# Altium schematic sheet 110_ESP32s3.SchDoc
size A4; SheetNumber: 12; SheetTotal: 12
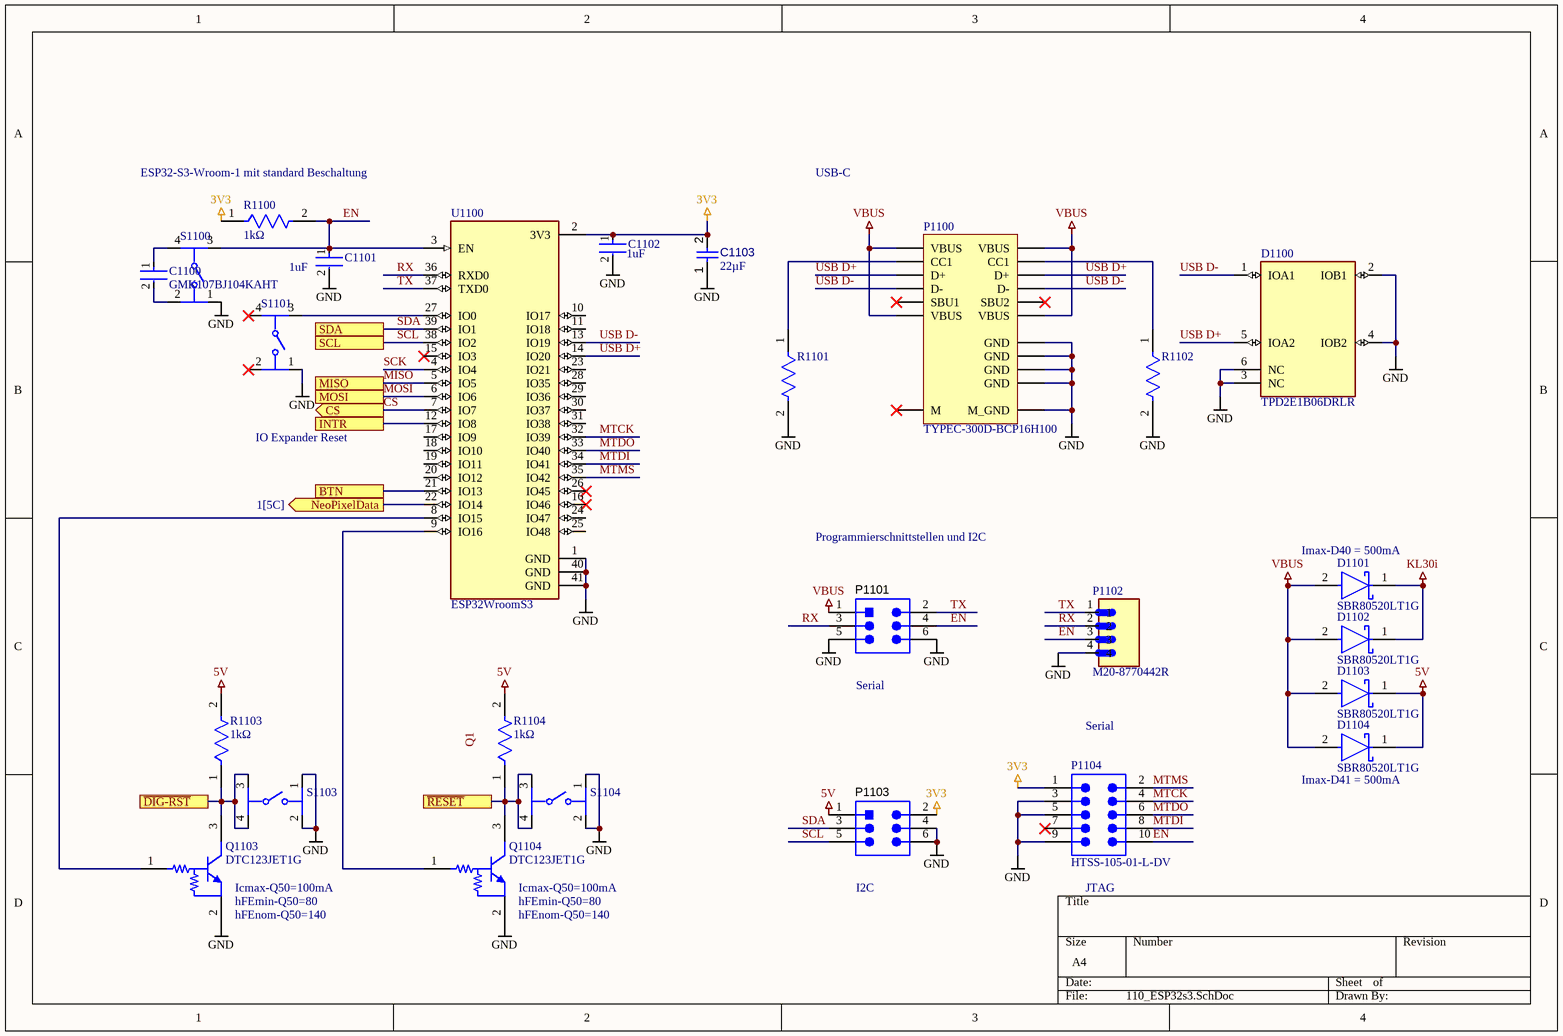
[diagram p0: 110_ESP32s3.SchDoc]

## Parts
C1100  GMK107BJ104KAHT  [FP-0603-L_1_6_0_1-W_0_8_0-IPC_B]
C1101  1uF  [FP-CGA3E-0_3-0_1-MFG]
C1102  1uF  [FP-CGA3E-0_3-0_1-MFG]
C1103  value 22µF  [CAPC0805(2012)145_L]  (hidden comment: Capacitor 22µF +/-40% 16V 0805)
D1100  TPD2E1B06DRLR  [FP-DRL0006A-MFG]
D1101  SBR80520LT1G  [FP-425-04-MFG]
D1102  SBR80520LT1G  [FP-425-04-MFG]
D1103  SBR80520LT1G  [FP-425-04-MFG]
D1104  SBR80520LT1G  [FP-425-04-MFG]
P1100  TYPEC-300D-BCP16H100  [TYPEC-300D-BCP16H100-Footprint-1]
P1101  5-146130-2  [TECO-5-146130-2_V]  (value not drawn)
P1102  M20-8770442R  [HARWIN_M20-8770442R]
P1103  5-146130-2  [TECO-5-146130-2_V]  (value not drawn)
P1104  HTSS-105-01-L-DV  [SMTC-HTSS-105-01-X-DV]
Q1103  DTC123JET1G  [ONSC-SC-75-3-463-01_V]
Q1104  DTC123JET1G  [ONSC-SC-75-3-463-01_V]
R1100  1kΩ  [FP-CRCW0603-e3-MFG]
R1101  CRCW06035K10FKEA  [FP-CRCW0603-e3-IPC_C]  (value not drawn)
R1102  CRCW06035K10FKEA  [FP-CRCW0603-e3-IPC_C]  (value not drawn)
R1103  1kΩ  [FP-CRCW0603-e3-MFG]
R1104  1kΩ  [FP-CRCW0603-e3-MFG]
S1100  (no value)  [FP-PTS645SM43SMTR92LFS-MFG]
S1101  (no value)  [FP-PTS645SM43SMTR92LFS-MFG]
S1103  (no value)  [FP-PTS645SM43SMTR92LFS-MFG]
S1104  (no value)  [FP-PTS645SM43SMTR92LFS-MFG]
U1100  ESP32WroomS3  [ESP32WroomS3]

## Ports
BTN (see 1[5B], 7[4C]), CS (out, see 1[5B], 10[3C]), INTR (see 1[5C], 10[4C]), MISO (see 1[5C], 10[4C]), MOSI (see 1[5B], 10[3D]), NeoPixelData (out, see 1[5C]), SCL (see 1[5C], 2[1C], 6[1C], 9[6B]), SDA (see 1[5C], 2[1C], 6[1C], 9[6B]), ~{DIG-RST} (see 1[5C], 2[1D], 6[1D]), ~{RESET} (see 1[5C], 9[6B])

## Nets
3V3: C1102.1 C1103.2 P1103.2 P1104.1 R1100.1 U1100.2(3V3)
5V: D1103.1(C) D1104.1(C) P1103.1 R1103.2 R1104.2
GND: C1101.2 C1102.2 C1103.1 D1100.2(IOB1) D1100.3(NC) D1100.4(IOB2) D1100.6(NC) P1100.A1(GND) P1100.A12(GND) P1100.B1(GND) P1100.B12(GND) P1100.M_GND P1101.5 P1101.6 P1102.4 P1103.4 P1103.6 P1104.3 P1104.5 P1104.9 Q1103.2(E) Q1104.2(E) R1101.2 R1102.2 S1100.1 S1101.1 S1103.1 S1103.2 S1104.1 S1104.2 U1100.1(GND) U1100.40(GND) U1100.41(GND)
KL30i: D1101.1(C) D1102.1(C)
VBUS: D1101.2(A) D1102.2(A) D1103.2(A) D1104.2(A) P1100.A4(VBUS) P1100.A9(VBUS) P1100.B4(VBUS) P1100.B9(VBUS) P1101.1
BTN: U1100.21(IO13) ; port BTN
CS: U1100.7(IO7) ; port CS
~{DIG-RST}: Q1103.3(C) R1103.1 S1103.3 S1103.4 ; port ~{DIG-RST}
EN: C1101.1 P1101.4 P1102.3 P1104.10 R1100.2 S1100.3 U1100.3(EN)
INTR: U1100.12(IO8) ; port INTR
MISO: U1100.5(IO5) ; port MISO
MOSI: U1100.6(IO6) ; port MOSI
MTCK: P1104.4 U1100.32(IO39)
MTDI: P1104.8 U1100.34(IO41)
MTDO: P1104.6 U1100.33(IO40)
MTMS: P1104.2 U1100.35(IO42)
NeoPixelData: U1100.22(IO14) ; port NeoPixelData
~{RESET}: Q1104.3(C) R1104.1 S1104.3 S1104.4 ; port ~{RESET}
RX: P1101.3 P1102.2 U1100.36(RXD0)
SCK: U1100.4(IO4)
SCL: P1103.5 U1100.38(IO2) ; port SCL
SDA: P1103.3 U1100.39(IO1) ; port SDA
TX: P1101.2 P1102.1 U1100.37(TXD0)
USB D+: D1100.5(IOA2) P1100.A6(D+) P1100.B6(D+) U1100.14(IO20)
USB D-: D1100.1(IOA1) P1100.A7(D-) P1100.B7(D-) U1100.13(IO19)
NetC1100_1: C1100.1 S1100.4
NetC1100_2: C1100.2 S1100.2
NetP1100_A5: P1100.A5(CC1) R1101.1
NetP1100_B5: P1100.B5(CC1) R1102.1
NetQ1103_1: Q1103.1(B) U1100.8(IO15)
NetQ1104_1: Q1104.1(B) U1100.9(IO16)
NetS1101_3: S1101.3 U1100.27(IO0)

Not connected (* = marked no-connect by the designer): P1100 A8(SBU1)* B8(SBU2)* M*; P1104 7*; S1101 2* 4*; U1100 10(IO17) 11(IO18) 15(IO3)* 16(IO46)* 17(IO9) 18(IO10) 19(IO11) 20(IO12) 23(IO21) 24(IO47) 25(IO48) 26(IO45)* 28(IO35) 29(IO36) 30(IO37) 31(IO38)

## Notes on the sheet
- (near R1100) ESP32-S3-Wroom-1 mit standard Beschaltung
- USB-C
- IO Expander Reset
- Programmierschnittstellen und I2C
- (near D1101) Imax-D40 = 500mA
- (near P1101) Serial
- Serial
- (near D1104) Imax-D41 = 500mA
- (near Q1103) Icmax-Q50=100mA
- (near Q1103) hFEmin-Q50=80
- (near Q1103) hFEnom-Q50=140
- (near Q1104) Icmax-Q50=100mA
- (near Q1104) hFEmin-Q50=80
- (near Q1104) hFEnom-Q50=140
- (near P1103) I2C
- (near P1104) JTAG
- Labels drawn without touching a wire or pin: Q1

## Library data of the parts
C1100 = CMP-14477-002194-3: Ceramic Capacitor Automotive 0.1uF ±10% 35V X5R 0603; NexarPartId: 29103042; Capacitance: 100nF; Packaging: Digi-Reel®; Height: 900µm; Width: 800µm; Thickness: 889µm; Min Operating Temperature: -55°C; Termination: SMD/SMT; Mount: Surface Mount; Ratings: AEC-Q200; Halogen Free: Halogen Free; Tolerance: 10%; Max Operating Temperature: 85°C; Case Code (Metric): 1608; Case/Package: 0603; Lead Free: Lead Free; Case Code (Imperial): 0603; Length: 1.6002mm; Voltage Rating: 35V; Voltage Rating (DC): 35V; Dielectric: X5R; Min Width: 700µm; Min Length: 1.5mm; Max Length: 1.7mm; Material: Ceramic; Min Thickness: 700µm; Max Thickness: 900µm; RoHS: Compliant; Max Width: 900µm
C1101 C1102 = CMP-08246-002551-1: Cap Ceramic 1uF 35V X7R 10% Pad SMD 0603 +125°C Automotive T/R / CGA3E1X7R1V105K080AC; Termination: SMD/SMT; Packaging: Tape and Reel; Capacitance: 1uF; Tolerance: 10%; Mount: Surface Mount; Thickness: 0.035inch; Case Code (Imperial): 0603; Voltage Rating: 35V; Case/Package: 0603; Case Code (Metric): 1608; Dielectric: X7R; Width: 0.031inch; Length: 0.063inch; Min Operating Temperature: -55°C; Weight: 7.1E-05oz; Max Operating Temperature: 125°C; Voltage Rating (DC): 35V; Height: 0.8mm; Ratings: AEC-Q200; Package Quantity: 4000
C1103 = CMP-001-00081-4: Chip Capacitor, 22µF +/-40%, 16V, 0805, Thickness 1.45 mm; Tolerance: 5%; Voltage Rating: 16V; Mounting Technology: SMT; Pins: 2; Max Operating Temperature: 85°C; Case/Package: 0805; Min Operating Temperature: -55°C
D1100 = CMP-04985-000003-1: TVS DIODE 5.5V 15V 6SOT; Manufacturer: Texas Instruments; Peak Pulse Power: 35W; Peak Pulse Current: 2.5A; Direction: Bidirectional; Standoff Height: 0mm; Interface: I2C,USB,LVDS,Other; Number Of Channels: 2; Breakdown Voltage: 7V; Ambient Temperature Range High: +125°C; Package: DRL0006A; Automotive: No; Lead Free: Yes; Temperature Range Low: -40°C; Reverse Standoff Voltage: 5.5V; Clamping Voltage: 15V; Mouser Description: ESD Suppressors / TVS Diodes 2-CH system level ESD protect device; Temperature Range High: +125°C; Device Class L1: Circuit Protection; ComponentLink2Description: Datasheet; RoHS: TRUE; Ambient Temperature Range Low: -40°C; Height: 0.6mm; Device Class L3: unset; Device Class L2: ESD and Circuit Protection ICs; Temperature: -40°C to +125°C; Octopart: https://octopart.com/tpd2e1b06drlr-texas+instruments-30488860; ComponentLink2URL: http://www.ti.com/lit/ds/symlink/tpd2e1b06.pdf; Category: Diode; Manufacturer Part Number: TPD2E1B06DRLR; Digikey Description: TVS DIODE 5.5V 15V 6SOT
D1101-D1104 = CMP-1055-00426-2: DIODE SCHOTTKY 20V 500MA SOD123; Forward Voltage: 385mV; Element Configuration: Single; Max Forward Surge Current (Ifsm): 5.5A; Peak Reverse Current: 250uA; Min Operating Temperature: -65°C; Case/Package: SOD-123-2; Halogen Free: Halogen Free; Number of Pins: 2; Max Operating Temperature: 125°C; Average Rectified Current: 500mA; Weight: 0.000363oz; Height: 1.17mm; Reverse Voltage (DC): 20V; Forward Current: 500mA; Max Reverse Voltage (DC): 20V; Width: 1.6mm; Termination: SMD/SMT; Max Repetitive Reverse Voltage (Vrrm): 20V; Package Quantity: 3000; Length: 2.69mm; Lead Free: Lead Free; Peak Non-Repetitive Surge Current: 5.5A; Packaging: Tape and Reel
P1100 = CMP-002-00081-3: Vertical USB Type C Connector
P1101 P1103 = CMP-1684-00011-1: Male Header, Pitch 2.54 mm, 2 x 3 Position, Height 8.13 mm, -65 to 125 degC, RoHS, Tube; Max Supply Voltage: 5.5 V; Min Supply Voltage: 4.5 V; Nominal Supply Voltage: 5 V; Min Operating Temperature: -40 degC; ComponentLink1URL: http://www.te.com/; ComponentLink2Description: Datasheet; Pins: 3; Max Operating Temperature: 150 degC; PackageDescription: Male Header, Pitch 2.54 mm, 2 x 3 Position, Height 8.13 mm; Package Quantity: 3000; PackageReference: 5-146130-2; DatasheetVersion: Oct-15; ComponentLink1Description: Manufacturer URL; Radiation Hardening: No; Mount: Surface Mount; RoHSCompliant: true; Packaging: Tape and Reel; ComponentLink2URL: http://www.te.com/commerce/DocumentDelivery/DDEController?Action=showdoc&DocId=Customer+Drawing%7F146130%7FM%7Fpdf%7FEnglish%7FENG_CD_146130_M.pdf%7F5-146130-2
P1102 = M20-8770442R: Connector Header Surface Mount 4 position 0.100 (2.54mm); MF: Harwin Inc.; Package: None; Price: None; Check_prices: https://www.snapeda.com/parts/M20-8770442R/Harwin+Inc./view-part/?ref=eda; Value: *; SnapEDA_Link: https://www.snapeda.com/parts/M20-8770442R/Harwin+Inc./view-part/?ref=snap; MP: M20-8770442R; Availability: In Stock; Purchase-URL: https://pricing.snapeda.com/search?q=M20-8770442R&ref=eda
P1104 = CMP-1024-00042-1: Shrouded .025" SQ Post Header, Surface Mount, Vertical, -55 to 125 degC, 2.54 mm Pitch, 10-Pin, Male, RoHS; Manufacturer: Samtec; Pitch: 2.54 mm; ComponentLink1URL: http://www.samtec.com; Mounting Technology: Surface Mount; ComponentLink3URL: http://www.samtec.com/documents/webfiles/cpdf/HTSS-1XX-01-XX-DV-X-XX-X-XX-MKT.pdf; ComponentLink2URL: http://www.samtec.com/documents/webfiles/pdf/htss.pdf; ComponentLink3Description: Package Specification; Orientation: Vertical; PackageDescription: High Temp Top Shroud; ComponentLink2Description: Datasheet; PackageVersion: Z, 7/2001; ComponentLink1Description: Manufacturer URL; Temperature Range: -55 to 125 degC; RoHS: True; PackageReference: HTSS-105-01-X-DV; DatasheetVersion: F-214; PartNumber: HTSS-105-01-L-DV
Q1103 Q1104 = CMP-0630-00201-1: Digital Transistor (BRT), R1=2.2 kOhm, R2=47 kOhm, NPN Transistor, 3-Pin SC-75, Pb-Free, Tape and Reel; Manufacturer: On Semiconductor; V(BR)CEO Min (V): 50; hFE Min: 80; R1/R2 Typ: 0.047; IC Continuous (A): 0.1; ComponentLink1URL: http://www.onsemi.com/; ComponentLink2URL: http://www.onsemi.cn/pub_link/Collateral/DTC123J-D.PDF; DatasheetVersion: Rev. 1; Mounting Technology: Surface Mount; ComponentLink2Description: Datasheet; PartNumber: DTC123JET1G; PackageDescription: 3-Pin Small Outline Transistor, Body 1.6 x 0.8 mm, Pitch 0.5 mm; Polarity: NPN; PackageVersion: Rev. F, 07/2005; ComponentLink3Description: Package Specification; PackageReference: SC-75-3-463-01; Packing: Tape and Reel; ComponentLink3URL: http://www.onsemi.com/pub_link/Collateral/463-01.PDF; ComponentLink1Description: Manufacturer URL; RoHS: TRUE
R1100 R1103 R1104 = CMP-1666-00003-5: RES Thick Film, 1kΩ, 1%, 0.1W, 100ppm/°C, 0603, CRCW06031K00FKEA; Max Power Dissipation: 100mW; Voltage Rating: 75V; Resistance: 1kR; Max Operating Temperature: 155°C; Number of Pins: 2; Case Code (Imperial): 0603; Width: 0.033inch; Power Rating: 100mW; Number of Terminations: 2; Package Quantity: 10; Weight: 7.1E-05oz; Tolerance: 1%; Temperature Coefficient: 100ppm/°C; Military Standard: Not; Mount: Surface Mount; Voltage Rating (DC): 75V; Depth: 0.85mm; Composition: Thick Film; Radiation Hardening: No; Termination: SMD/SMT; Length: 1.55mm; Case Code (Metric): 1608; Contact Plating: Tin; Min Operating Temperature: -55°C; Packaging: Tape and Reel; Height: 0.45mm; Lead Free: Lead Free; Case/Package: 0603; Features: Automotive AEC-Q200
R1101 R1102 = CMP-1012-00590-3: RES Thick Film, 5.1kΩ, 1%, 0.1W, 100ppm/°C, 0603; Power Rating: 100mW; Voltage Rating (DC): 75V; Resistance: 5.1kR; Width: 0.85mm; Depth: 0.85mm; Military Standard: Not; Package Quantity: 5000; Case Code (Metric): 1608; Length: 1.55mm; Weight: 7.1E-05oz; Packaging: Tape and Reel; Temperature Coefficient: 100ppm/°C; Case Code (Imperial): 0603; Lead Free: Lead Free; Radiation Hardening: No; Contact Plating: Tin; Composition: Thick Film; Max Operating Temperature: 155°C; Termination: SMD/SMT; Case/Package: 0603; Min Operating Temperature: -55°C; Tolerance: 1%; Voltage Rating: 75V; Mount: Surface Mount; Height: 0.45mm
S1100 S1101 S1103 S1104 = CMP-2000-05160-2: SWITCH TACTILE SPST-NO 0.05A 12V / PTS645SM43SMTR92LFS; Contact Resistance: 100mR; Throw Configuration: SPST; Illumination Type: Non-Illuminated; Mechanical Life: 100000Cycles; Current Rating: 50mA; Switch Function: Off-Mom; Actuator Length: 0.85mm; Actuator Material: Nylon; Actuator Type: Standard; Operating Force: 160gf; Min Operating Temperature: -20°C; REACH SVHC: No SVHC; Termination: Gull Wing; Case/Package: SMD/SMT; Packaging: Tape and Reel; Mount: Surface Mount; Voltage Rating (DC): 12V; Orientation: Straight; Lead Free: Lead Free; Contact Material: Silver; Color: Black; Max Current Rating: 50mA; Contact Plating: Silver; Depth: 9mm; Package Quantity: 1; Max Voltage Rating (DC): 12V; Length: 6mm; Max Operating Temperature: 60°C
U1100 = CMP-017-000002-1: Design Item ID: ESP32WroomS3; Source: Schaltdose.SchLib